# Altium schematic sheet Nwatch.SchDoc
size A3
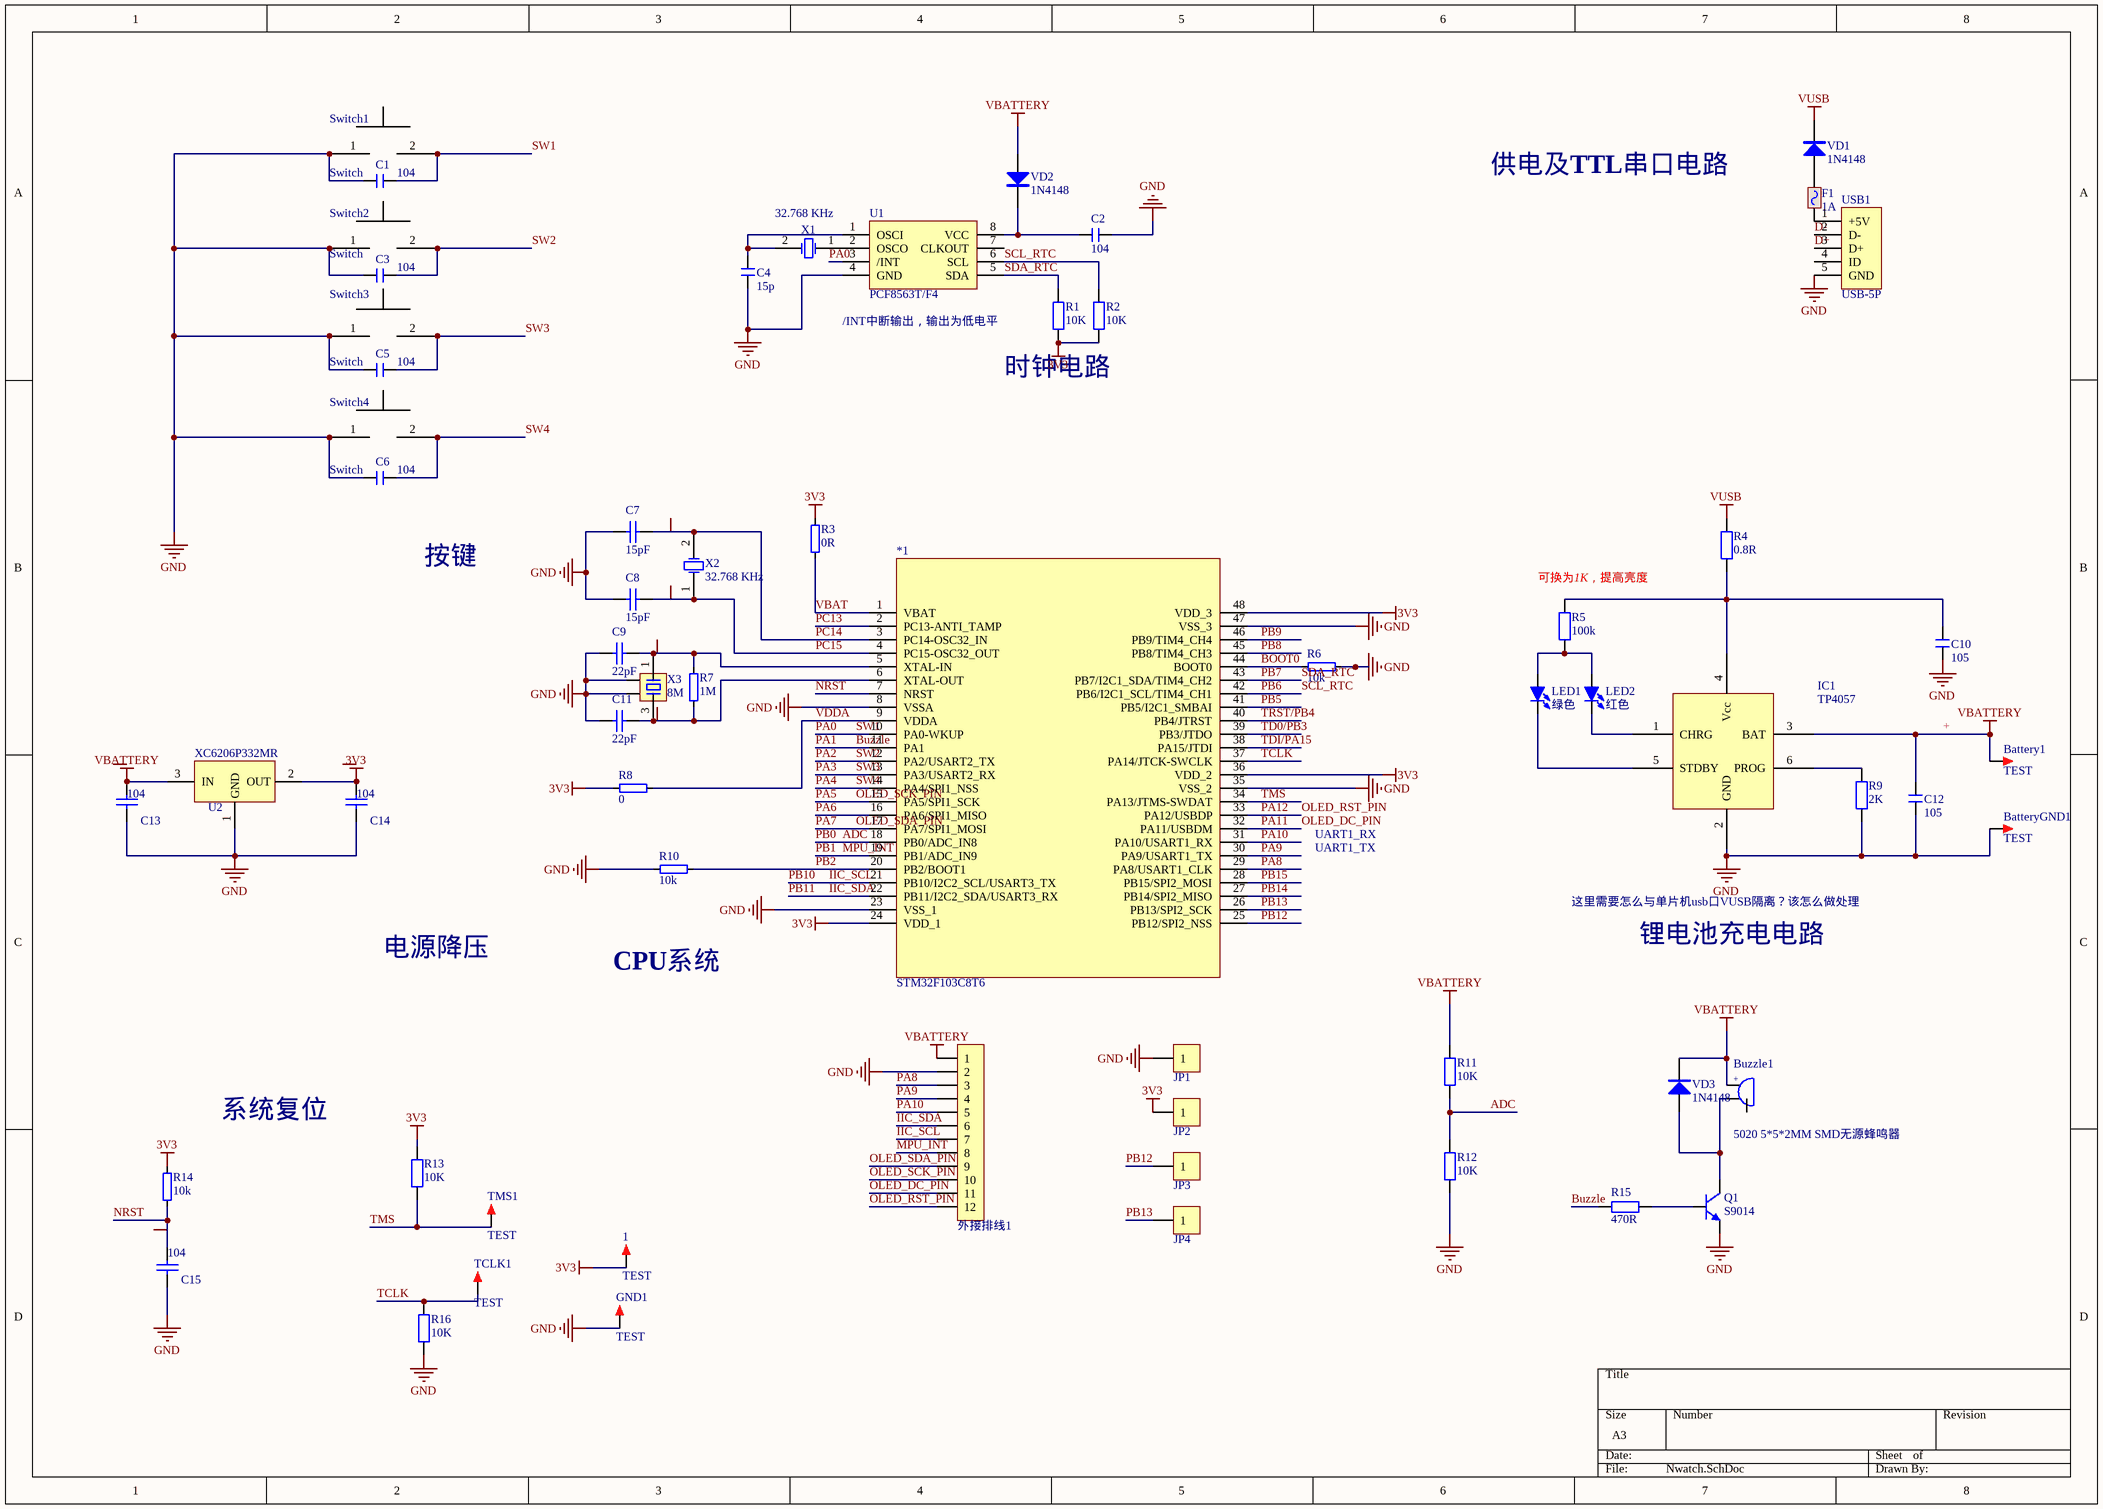
[diagram p0: Nwatch.SchDoc]

## Parts
1  TEST  [TEST 1.6]
*1  STM32F103C8T6  [LQFP48 7x7_M]
Battery1  TEST  [TEST 1.6]
BatteryGND1  TEST  [TEST 1.6]
Buzzle1  5020 5*5*2MM SMD无源蜂鸣器  [5020 5*5*2MM SMD贴片超薄超小电磁式无源蜂鸣器]
C1  104  [C 0805]
C2  104  [C 0805]
C3  104  [C 0805]
C4  15p  [C 0805]
C5  104  [C 0805]
C6  104  [C 0805]
C7  15pF  [C 0805]
C8  15pF  [C 0805]
C9  22pF  [C 0805]
C10  105  [C 0805]
C11  22pF  [C 0805]
C12  105  [C 0805]
C13  104  [C 0805]
C14  104  [C 0805]
C15  104  [C 0805]
F1  1A  [R 0603]
GND1  TEST  [TEST 1.6]
IC1  TP4057  [SOT23-6N]
JP1  HDR-1X1  [HDR-1X1]  (value not drawn)
JP2  HDR-1X1  [HDR-1X1]  (value not drawn)
JP3  HDR-1X1  [HDR-1X1]  (value not drawn)
JP4  HDR-1X1  [HDR-1X1]  (value not drawn)
LED1  绿色  [LED 0603G]
LED2  红色  [LED 0603R]
Q1  S9014  [SOT23-3L]
R1  10K  [R 0805]
R2  10K  [R 0805]
R3  0R  [R 0805]
R4  0.8R  [R 0805]
R5  100k  [R 0805]
R6  10k  [R 0805]
R7  1M  [R 0805]
R8  0  [R 0805]
R9  2K  [R 0805]
R10  10k  [R 0805]
R11  10K  [R 0805]
R12  10K  [R 0805]
R13  10K  [R 0805]
R14  10k  [R 0805]
R15  470R  [R 0805]
R16  10K  [R 0805]
Switch1  Switch  [侧按键]
Switch2  Switch  [侧按键]
Switch3  Switch  [侧按键]
Switch4  Switch  [侧按键]
TCLK1  TEST  [TEST 1.6]
TMS1  TEST  [TEST 1.6]
U1  PCF8563T/F4  [SOP8W_L]
U2  XC6206P332MR  [SOT23-3L]
USB1  USB-5P  [USB-MICRO_A]
VD1  1N4148  [SOD-323]
VD2  1N4148  [SOD-323]
VD3  1N4148  [SOD-323]
X1  32.768 KHz  [XTAL-3215]
X2  32.768 KHz  [XTAL-3215]
X3  8M  [XTAL-5032]
外接排线1  HDR-1X12  [HDR-1X12]  (value not drawn)

## Nets
3V3: 1.1 *1.24(VDD_1) *1.36(VDD_2) *1.48(VDD_3) C14.2 JP2.1 R1.1 R2.1 R3.1 R8.1 R13.2 R14.2 U2.2(OUT)
+: Battery1.1 Buzzle1.1 C12.2 C13.2 IC1.3(BAT) R11.2 U2.3(IN) VD2.1(A) VD3.2(K) 外接排线1.1  [also labelled VBATTERY]
GND: *1.8(VSSA) *1.23(VSS_1) *1.35(VSS_2) *1.47(VSS_3) BatteryGND1.1 C1.1 C2.2 C3.1 C4.1 C5.1 C6.1 C7.1 C8.1 C9.1 C10.1 C11.1 C12.1 C13.1 C14.1 C15.1 GND1.1 IC1.2(GND) JP1.1 Q1.2(E) R6.2 R9.1 R10.1 R12.1 R16.1 Switch1.1 Switch2.1 Switch3.1 Switch4.1 U1.4(GND) U2.1(GND) USB1.5(GND) X3.2 X3.4 外接排线1.2
VUSB: R4.2 VD1.2(K)
ADC: *1.18(PB0/ADC_IN8) R11.1 R12.2  [also labelled PB0]
BOOT0: *1.44(BOOT0) R6.1
Buzzle: *1.11(PA1) R15.1  [also labelled PA1]
D+: USB1.3(D+)
D-: USB1.2(D-)
IIC_SCL: *1.21(PB10/I2C2_SCL/USART3_TX) 外接排线1.7  [also labelled PB10]
IIC_SDA: *1.22(PB11/I2C2_SDA/USART3_RX) 外接排线1.6  [also labelled PB11]
MPU_INT: *1.19(PB1/ADC_IN9) 外接排线1.8  [also labelled PB1]
NRST: *1.7(NRST) C15.2 R14.1
OLED_DC_PIN: *1.32(PA11/USBDM) 外接排线1.11  [also labelled PA11]
OLED_RST_PIN: *1.33(PA12/USBDP) 外接排线1.12  [also labelled PA12]
OLED_SCK_PIN: *1.15(PA5/SPI1_SCK) 外接排线1.10  [also labelled PA5]
OLED_SDA_PIN: *1.17(PA7/SPI1_MOSI) 外接排线1.9  [also labelled PA7]
PA0: *1.10(PA0-WKUP) C1.2 Switch1.2 U1.3(/INT)  [also labelled SW1]
PA2: *1.12(PA2/USART2_TX) C3.2 Switch2.2  [also labelled SW2]
PA3: *1.13(PA3/USART2_RX) C5.2 Switch3.2  [also labelled SW3]
PA4: *1.14(PA4/SPI1_NSS) C6.2 Switch4.2  [also labelled SW4]
PA6: *1.16(PA6/SPI1_MISO)
PA8: *1.29(PA8/USART1_CLK) 外接排线1.3
PA9: *1.30(PA9/USART1_TX) 外接排线1.4
PA10: *1.31(PA10/USART1_RX) 外接排线1.5
PB2: *1.20(PB2/BOOT1) R10.2
PB5: *1.41(PB5/I2C1_SMBAI)
PB6: *1.42(PB6/I2C1_SCL/TIM4_CH1) R2.2 U1.6(SCL)  [also labelled SCL_RTC]
PB7: *1.43(PB7/I2C1_SDA/TIM4_CH2) R1.2 U1.5(SDA)  [also labelled SDA_RTC]
PB8: *1.45(PB8/TIM4_CH3)
PB9: *1.46(PB9/TIM4_CH4)
PB12: *1.25(PB12/SPI2_NSS) JP3.1
PB13: *1.26(PB13/SPI2_SCK) JP4.1
PB14: *1.27(PB14/SPI2_MISO)
PB15: *1.28(PB15/SPI2_MOSI)
PC13: *1.2(PC13-ANTI_TAMP)
PC14: *1.3(PC14-OSC32_IN) C7.2 X2.2(OSC2)
PC15: *1.4(PC15-OSC32_OUT) C8.2 X2.1(OSC1)
TCLK: *1.37(PA14/JTCK-SWCLK) R16.2 TCLK1.1
TD0/PB3: *1.39(PB3/JTDO)
TDI/PA15: *1.38(PA15/JTDI)
TMS: *1.34(PA13/JTMS-SWDAT) R13.1 TMS1.1
TRST/PB4: *1.40(PB4/JTRST)
VBAT: *1.1(VBAT) R3.2
VDDA: *1.9(VDDA) R8.2
Net*1_5: *1.5(XTAL-IN) C9.2 R7.2 X3.1
Net*1_6: *1.6(XTAL-OUT) C11.2 R7.1 X3.3
NetBuzzle1_2: Buzzle1.2 Q1.3(C) VD3.1(A)
NetC2_1: C2.1 U1.8(VCC) VD2.2(K)
NetC4_2: C4.2 U1.1(OSCI) X1.2(OSC2)
NetC10_2: C10.2 IC1.4(Vcc) R4.1 R5.2
NetF1_1: F1.1 VD1.1(A)
NetF1_2: F1.2 USB1.1(+5V)
NetIC1_1: IC1.1(CHRG) LED2.2(K)
NetIC1_5: IC1.5(STDBY) LED1.2(K)
NetIC1_6: IC1.6(PROG) R9.2
NetLED1_1: LED1.1(A) LED2.1(A) R5.1
NetQ1_1: Q1.1(B) R15.2
NetU1_2: U1.2(OSCO) X1.1(OSC1)

Not connected (* = marked no-connect by the designer): Buzzle1 3; U1 7(CLKOUT); USB1 4(ID)

## Notes on the sheet
- 供电及TTL串口电路
- (near U1) /INT中断输出，输出为低电平
- 时钟电路
- 按键
- (near R5) 可换为1K，提高亮度
- UART1_TX
- UART1_RX
- 这里需要怎么与单片机usb口VUSB隔离？该怎么做处理
- 电源降压
- CPU系统
- 锂电池充电电路
- (near R14) 系统复位
- (in symbol 5020 SMD无源蜂鸣器) +

## Library data of the parts
1 Battery1 BatteryGND1 GND1 TCLK1 TMS1 = TEST: 测试点; 版权归属: 源创客; BOM名称: 测试点; 学习资源: www.ooocke.com
Buzzle1 = 5020 SMD无源蜂鸣器: 5020 5*5*2MM SMD贴片超薄超小电磁式无源蜂鸣器
C1-C6 C10 C12 = C: 无极性贴片电容; 版权归属: 源创客; BOM名称: 无极性贴片电容; 学习资源: www.ooocke.com
C7-C9 C11 C13-C15 = Cap  贴片
F1 = FUSE
IC1 = TP4057/4059: 500mA/600mA锂电池充电管理IC
JP1-JP4 = Header 1: 1P接插件; 版权归属: 源创客; BOM名称: 1P接插件; 学习资源: www.ooocke.com
LED1 LED2 = LED-SMD: 贴片LED; 版权归属: 源创客; BOM名称: 贴片LED; 学习资源: www.ooocke.com
Q1 = 9014-SMD: 低噪放大-NPN型; 版权归属: 源创客; 属性: 50V 0.1A 0.4W 150MHZ; BOM名称: 低噪放大-NPN型; 学习资源: www.ooocke.com
R1 R2 R4 R5 R9 R11-R13 R15 R16 = R: 贴片电阻; 版权归属: 源创客; BOM名称: 贴片电阻; 学习资源: www.ooocke.com
R3 R6-R8 R10 R14 = Res  贴片
Switch1-Switch4 = 2X4X3.5侧按键: 测贴 轻触开关 2*4*3.5MM
U1 = PCF8563T: 时钟芯片
U2 = AMS1117
USB1 = USB-5P: 微型USB母座; 版权归属: 源创客; BOM名称: 微型USB母座; 学习资源: www.ooocke.com
VD1-VD3 = 1N4148: 高速开关二极管; 版权归属: 源创客; BOM名称: 高速开关二极管; 学习资源: www.ooocke.com
X1 X2 = XTAL: Crystal Oscillator; Published: 8-Jun-2000; LatestRevisionDate: 17-Jul-2002; LatestRevisionNote: Re-released for DXP Platform.; PackageReference: R38; Publisher: Altium Limited; PackageDescription: Crystal, Thru-Hole; 2 Leads; Body 3.1 x 8.2 mm (Dia.xH)
X3 = XTAL-4: 4脚晶振; 版权归属: 源创客; BOM名称: 4脚晶振; 学习资源: www.ooocke.com
外接排线1 = Header 12: 12P接插件; 版权归属: 源创客; BOM名称: 12P接插件; 学习资源: www.ooocke.com